# Altium schematic sheet Project overview.SchDoc: Project overview
size A4; Date: Not used; ApprovedBy: Not used; CheckedBy: Not used; Author: Not used; CompanyName: STMicroelectronics; DrawnBy: Not used; Engineer: Not used; Organization: Not used; Address1: Not used; Address2: Not used; Address3: Not used; Address4: Not used; DocumentNumber: 2; Revision: Not used; SheetNumber: 1; SheetTotal: 19; CurrentTime: Not used; CurrentDate: Not used; Time: Not used; DocumentFullPathAndName: Not used; DocumentName: Not used; ModifiedDate: Not used; ImagePath: Not used; ProjectName: Not used; Application_BuildNumber: Not used
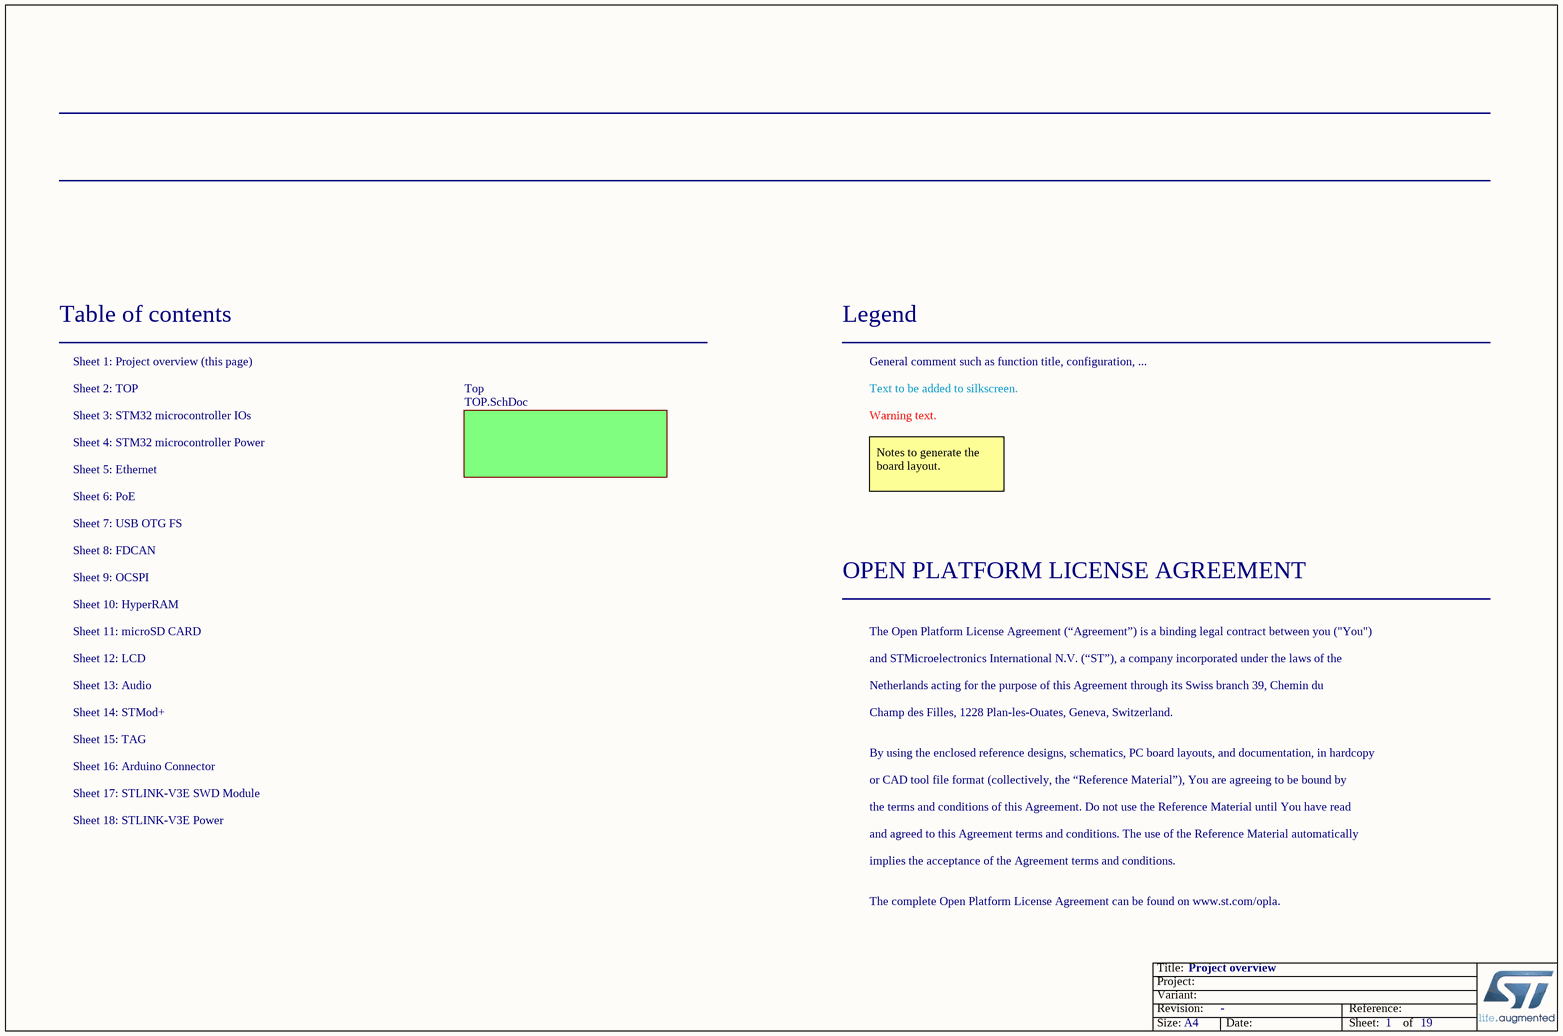
[diagram p0: Project overview.SchDoc]

## Sub-sheets
Top = TOP.SchDoc: no entries

## Notes on the sheet
- Table of contents
- Sheet 1: Project overview (this page)
- Legend
- General comment such as function title, configuration, ...
- Sheet 2: TOP
- Sheet 4: STM32 microcontroller Power
- Sheet 3: STM32 microcontroller IOs
- Text to be added to silkscreen.
- Warning text.
- Sheet 6: PoE
- Sheet 5: Ethernet
- Notes to generate the board layout.
- Sheet 8: FDCAN
- Sheet 7: USB OTG FS
- Sheet 9: OCSPI
- OPEN PLATFORM LICENSE AGREEMENT
- Sheet 10: HyperRAM
- Sheet 11: microSD CARD
- The Open Platform License Agreement (“Agreement”) is a binding legal contract between you ("You")
- Sheet 12: LCD
- Sheet 14: STMod+
- Sheet 13: Audio
- and STMicroelectronics International N.V. (“ST”), a company incorporated under the laws of the
- Netherlands acting for the purpose of this Agreement through its Swiss branch 39, Chemin du
- Champ des Filles, 1228 Plan-les-Ouates, Geneva, Switzerland.
- Sheet 16: Arduino Connector
- Sheet 15: TAG
- By using the enclosed reference designs, schematics, PC board layouts, and documentation, in hardcopy
- or CAD tool file format (collectively, the “Reference Material”), You are agreeing to be bound by
- Sheet 18: STLINK-V3E Power
- Sheet 17: STLINK-V3E SWD Module
- the terms and conditions of this Agreement. Do not use the Reference Material until You have read
- and agreed to this Agreement terms and conditions. The use of the Reference Material automatically
- implies the acceptance of the Agreement terms and conditions.
- The complete Open Platform License Agreement can be found on www.st.com/opla.
- Title:
- Project:
- Size:
- Revision:
- Variant:
- A4
- -
- Date:
- Reference:
- Sheet:
- of